# Altium schematic sheet can-stm32g4.SchDoc
size A4; SheetNumber: 8; SheetTotal: 8
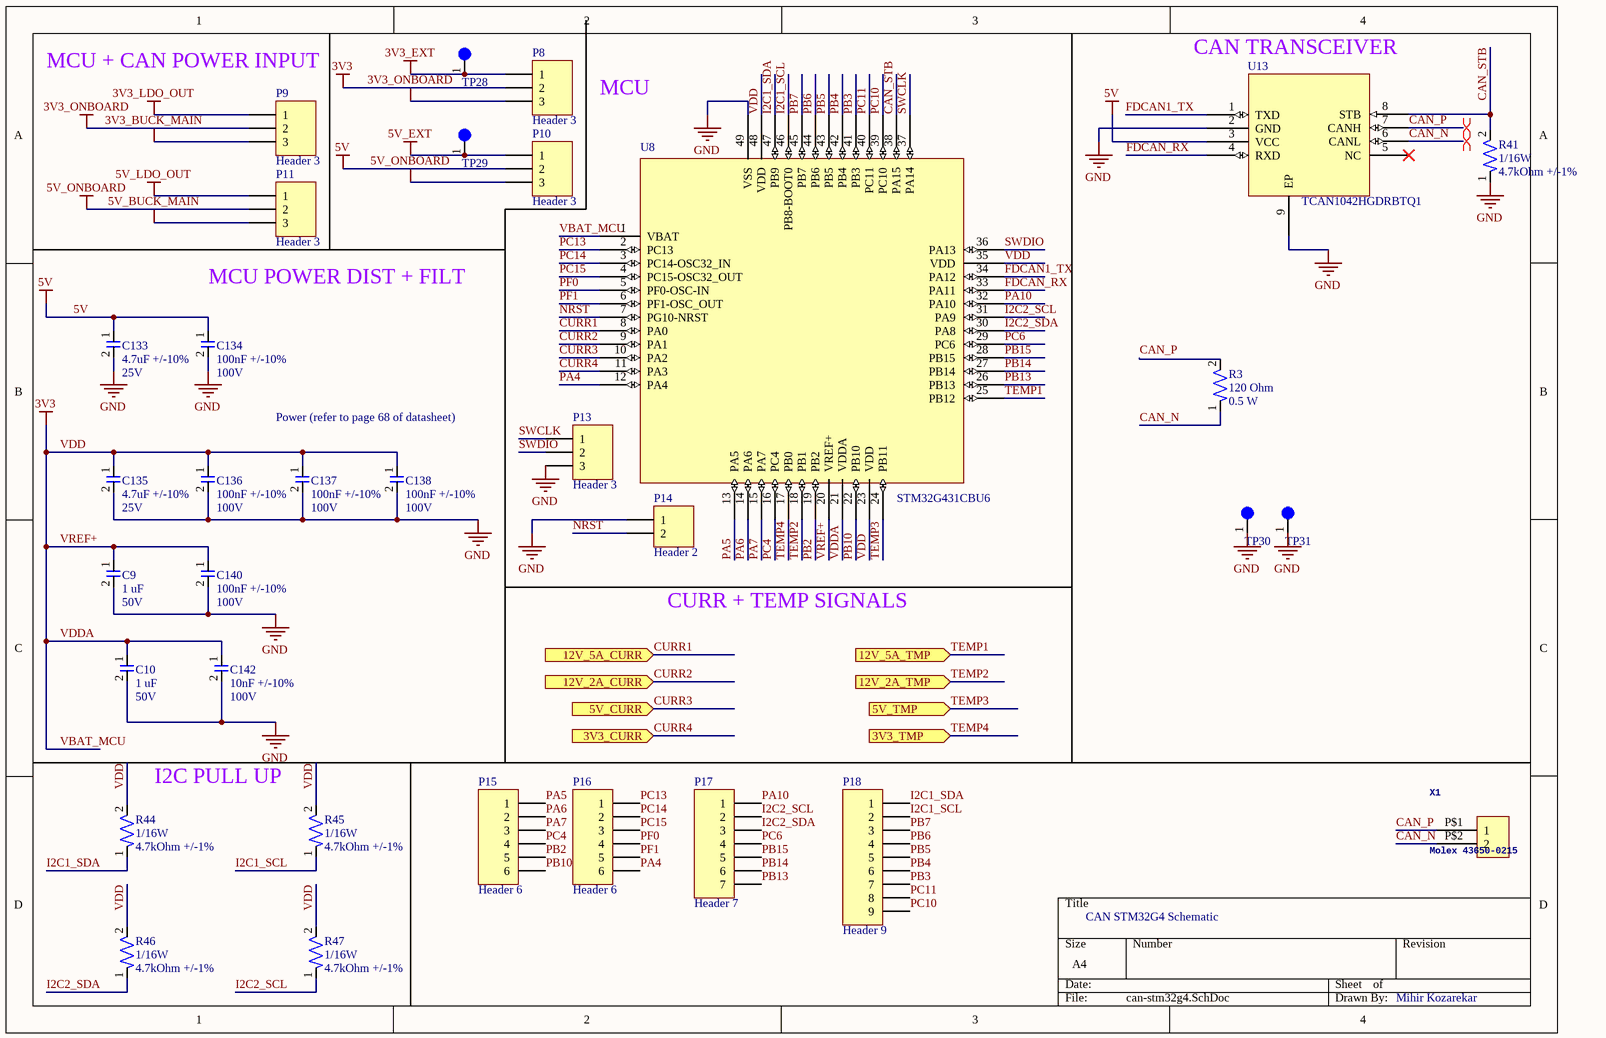
[diagram p0: can-stm32g4.SchDoc]

## Parts
C9  Capacitance: 1 uF  Voltage: 50V  [CAP-0603]  (hidden comment: UMK107AB7105KA-T)
C10  Capacitance: 1 uF  Voltage: 50V  [CAP-0603]  (hidden comment: UMK107AB7105KA-T)
C133  Capacitance: 4.7uF +/-10%  Voltage Rating: 25V  [CAP-0603]  (hidden comment: TMK107BBJ475KA-T)
C134  Capacitance: 100nF +/-10%  Voltage Rating: 100V  [CAP-0603]  (hidden comment: CC0603KRX7R0BB104)
C135  Capacitance: 4.7uF +/-10%  Voltage Rating: 25V  [CAP-0603]  (hidden comment: TMK107BBJ475KA-T)
C136  Capacitance: 100nF +/-10%  Voltage Rating: 100V  [CAP-0603]  (hidden comment: CC0603KRX7R0BB104)
C137  Capacitance: 100nF +/-10%  Voltage Rating: 100V  [CAP-0603]  (hidden comment: CC0603KRX7R0BB104)
C138  Capacitance: 100nF +/-10%  Voltage Rating: 100V  [CAP-0603]  (hidden comment: CC0603KRX7R0BB104)
C140  Capacitance: 100nF +/-10%  Voltage Rating: 100V  [CAP-0603]  (hidden comment: CC0603KRX7R0BB104)
C142  Capacitance: 10nF +/-10%  Voltage Rating: 100V  [CAP-0402]  (hidden comment: CC0402KRX7R0BB103)
P8  Header 3  [HDR1X3]
P9  Header 3  [HDR1X3]
P10  Header 3  [HDR1X3]
P11  Header 3  [HDR1X3]
P13  Header 3  [HDR1X3]
P14  Header 2  [HDR1X2]
P15  Header 6  [HDR1X6]
P16  Header 6  [HDR1X6]
P17  Header 7  [HDR1X7]
P18  Header 9  [HDR1X9]
R3  Resistance: 120 Ohm  Power: 0.5 W  [RES-1206]  (hidden comment: CRGH1206F120R)
R41  Power Rating: 1/16W  Resistance: 4.7kOhm +/-1%  [RES-0402]  (hidden comment: RC0402FR-074K7P)
R44  Power Rating: 1/16W  Resistance: 4.7kOhm +/-1%  [RES-0402]  (hidden comment: RC0402FR-074K7P)
R45  Power Rating: 1/16W  Resistance: 4.7kOhm +/-1%  [RES-0402]  (hidden comment: RC0402FR-074K7P)
R46  Power Rating: 1/16W  Resistance: 4.7kOhm +/-1%  [RES-0402]  (hidden comment: RC0402FR-074K7P)
R47  Power Rating: 1/16W  Resistance: 4.7kOhm +/-1%  [RES-0402]  (hidden comment: RC0402FR-074K7P)
TP28  5003  [TEST-POINT-0001]  (value not drawn)
TP29  5003  [TEST-POINT-0001]  (value not drawn)
TP30  5003  [TEST-POINT-0001]  (value not drawn)
TP31  5003  [TEST-POINT-0001]  (value not drawn)
U8  STM32G431CBU6  [MCU-UFQFPN48]
U13  TCAN1042HGDRBTQ1  [IC-8-VSON]
X1  Molex 43650-0215  [43650-0215]

## Ports
3V3_CURR (in), 3V3_TMP (in), 5V_CURR (in), 5V_TMP (in), 12V_2A_CURR (in), 12V_2A_TMP (in), 12V_5A_CURR (in), 12V_5A_TMP (in)

## Nets
3V3_BUCK_MAIN: P9.3
3V3_EXT: P8.1 TP28.1
3V3_LDO_OUT: P9.1
3V3_ONBOARD: P8.3 P9.2
5V: C133.1 C134.1 P10.2 U13.3(VCC)
5V_BUCK_MAIN: P11.3
5V_EXT: P10.1 TP29.1
5V_LDO_OUT: P11.1
5V_ONBOARD: P10.3 P11.2
GND: C9.2 C10.2 C133.2 C134.2 C135.2 C136.2 C137.2 C138.2 C140.2 C142.2 P13.3 P14.1 R41.1 TP30.1 TP31.1 U8.49(VSS) U13.2(GND) U13.9(EP)
VBAT_MCU: C9.1 C10.1 C135.1 C136.1 C137.1 C138.1 C140.1 C142.1 P8.2 R44.2 R45.2 R46.2 R47.2 U8.1(VBAT) U8.20(VREF+) U8.21(VDDA) U8.23(VDD) U8.35(VDD) U8.48(VDD)  [also labelled 3V3, VDD, VDDA, VREF+]
CAN_N: R3.1 U13.6(CANL) X1.P$2(2)
CAN_P: R3.2 U13.7(CANH) X1.P$1(1)
CAN_STB: R41.2 U8.38(PA15) U13.8(STB)
CURR1: U8.8(PA0) ; port 12V_5A_CURR
CURR2: U8.9(PA1) ; port 12V_2A_CURR
CURR3: U8.10(PA2) ; port 5V_CURR
CURR4: U8.11(PA3) ; port 3V3_CURR
FDCAN1_TX: U8.34(PA12) U13.1(TXD)
FDCAN_RX: U8.33(PA11) U13.4(RXD)
I2C1_SCL: P18.2 R45.1 U8.46(PB8-BOOT0)
I2C1_SDA: P18.1 R44.1 U8.47(PB9)
I2C2_SCL: P17.2 R47.1 U8.31(PA9)
I2C2_SDA: P17.3 R46.1 U8.30(PA8)
NRST: P14.2 U8.7(PG10-NRST)
PA4: P16.6 U8.12(PA4)
PA5: P15.1 U8.13(PA5)
PA6: P15.2 U8.14(PA6)
PA7: P15.3 U8.15(PA7)
PA10: P17.1 U8.32(PA10)
PB2: P15.5 U8.19(PB2)
PB3: P18.7 U8.41(PB3)
PB4: P18.6 U8.42(PB4)
PB5: P18.5 U8.43(PB5)
PB6: P18.4 U8.44(PB6)
PB7: P18.3 U8.45(PB7)
PB10: P15.6 U8.22(PB10)
PB13: P17.7 U8.26(PB13)
PB14: P17.6 U8.27(PB14)
PB15: P17.5 U8.28(PB15)
PC4: P15.4 U8.16(PC4)
PC6: P17.4 U8.29(PC6)
PC10: P18.9 U8.39(PC10)
PC11: P18.8 U8.40(PC11)
PC13: P16.1 U8.2(PC13)
PC14: P16.2 U8.3(PC14-OSC32_IN)
PC15: P16.3 U8.4(PC15-OSC32_OUT)
PF0: P16.4 U8.5(PF0-OSC-IN)
PF1: P16.5 U8.6(PF1-OSC_OUT)
SWCLK: P13.1 U8.37(PA14)
SWDIO: P13.2 U8.36(PA13)
TEMP1: U8.25(PB12) ; port 12V_5A_TMP
TEMP2: U8.18(PB1) ; port 12V_2A_TMP
TEMP3: U8.24(PB11) ; port 5V_TMP
TEMP4: U8.17(PB0) ; port 3V3_TMP

Not connected (* = marked no-connect by the designer): U13 5(NC)*

## Layout directives
differential pair: CAN_N, CAN_P

## Notes on the sheet
- (near P9) MCU + CAN POWER INPUT
- MCU
- (near U13) CAN TRANSCEIVER
- MCU POWER DIST + FILT
- Power (refer to page 68 of datasheet)
- CURR + TEMP SIGNALS
- I2C PULL UP
- CAN STM32G4 Schematic
- Mihir Kozarekar

## Library data of the parts
C9 C10 = CAP-1U-0002: 1 µF ±10% 50V Ceramic Capacitor X7R 0603 (1608 Metric); Package Size: 0603
C133 C135 = CAP-4.7U-0001: 4.7 µF ±10% 25V Ceramic Capacitor X5R 0603 (1608 Metric); Manufacturer: Taiyo Yuden; Assembled?: no; Manufacturer Part Number: TMK107BBJ475KA-T; Temperature Coefficient: X5R; Package Size: 0603
C134 C136-C138 C140 = CAP-100N-0001: CAP CER 0.1UF 100V X7R 0603; Manufacturer: YAGEO; Assembled?: no; Manufacturer Part Number: CC0603KRX7R0BB104; Temperature Coefficient: X7R; Package Size: 0603
C142 = CAP-10N-0001: 10000 pF ±10% 100V Ceramic Capacitor X7R 0402 (1005 Metric); Manufacturer: YAGEO; Assembled?: no; Manufacturer Part Number: CC0402KRX7R0BB103; Temperature Coefficient: X7R; Package Size: 0402
P8-P11 P13 = Header 3: Header, 3-Pin; LatestRevisionDate: 17-Jul-2002; LatestRevisionNote: Re-released for DXP Platform.; Publisher: Altium Limited
P14 = Header 2: Header, 2-Pin; LatestRevisionDate: 17-Jul-2002; LatestRevisionNote: Re-released for DXP Platform.; Publisher: Altium Limited
P15 P16 = Header 6: Header, 6-Pin; LatestRevisionDate: 17-Jul-2002; LatestRevisionNote: Re-released for DXP Platform.; Publisher: Altium Limited
P17 = Header 7: Header, 7-Pin; LatestRevisionDate: 17-Jul-2002; LatestRevisionNote: Re-released for DXP Platform.; Publisher: Altium Limited
P18 = Header 9: Header, 9-Pin; LatestRevisionDate: 17-Jul-2002; LatestRevisionNote: Re-released for DXP Platform.; Publisher: Altium Limited
R3 = RES-120-0002: 120 Ohms ±1% 0.5W, 1/2W Chip Resistor 1206 (3216 Metric) Thick Film; Tolerance: 1%; Package Size: 1206
R41 R44-R47 = RES-4.7K-0001: RES SMD 4.7K OHM 1% 1/16W 0402; Manufacturer: YAGEO; Assembled?: no; Manufacturer Part Number: RC0402FR-074K7P; Package Size: 0402
TP28-TP31 = TEST-POINT-0001: Oranange PC Test Point, Miniature Phoisphor Bronze Silver Plating Through Hole Mounting Type
U8 = IC-STM32G431CBU6: 128KB 1.71V~3.6V ARM-MSeries 32KB 170MHz FLASH 42 UFQFPN-48(7x7) Microcontroller Units (MCUs/MPUs/SOCs) ROHS; Assembled?: no; Manufacturer Part Number: STM32G431CBU6; Package: UFQFPN-48
U13 = IC-CAN-TRANSCEIVER-0002: 1/1 Transceiver CANbus 8-VSON (3x3); Manufacturer: Texas Instrument; CAN Capability: FD-CAN; Manufacturer Part Number: TCAN1042HGDRBTQ1
X1 = Micro-Fit Molex 2 Pin Vertical: GateName_1: G$1; SymbolName_1: HEADER_POS2; DeviceSetName: HEADER_POS2_?; DeviceName: 43650-0215; LibraryName: con-molex-micro-fit-3_0_2; Package: 43650-0215